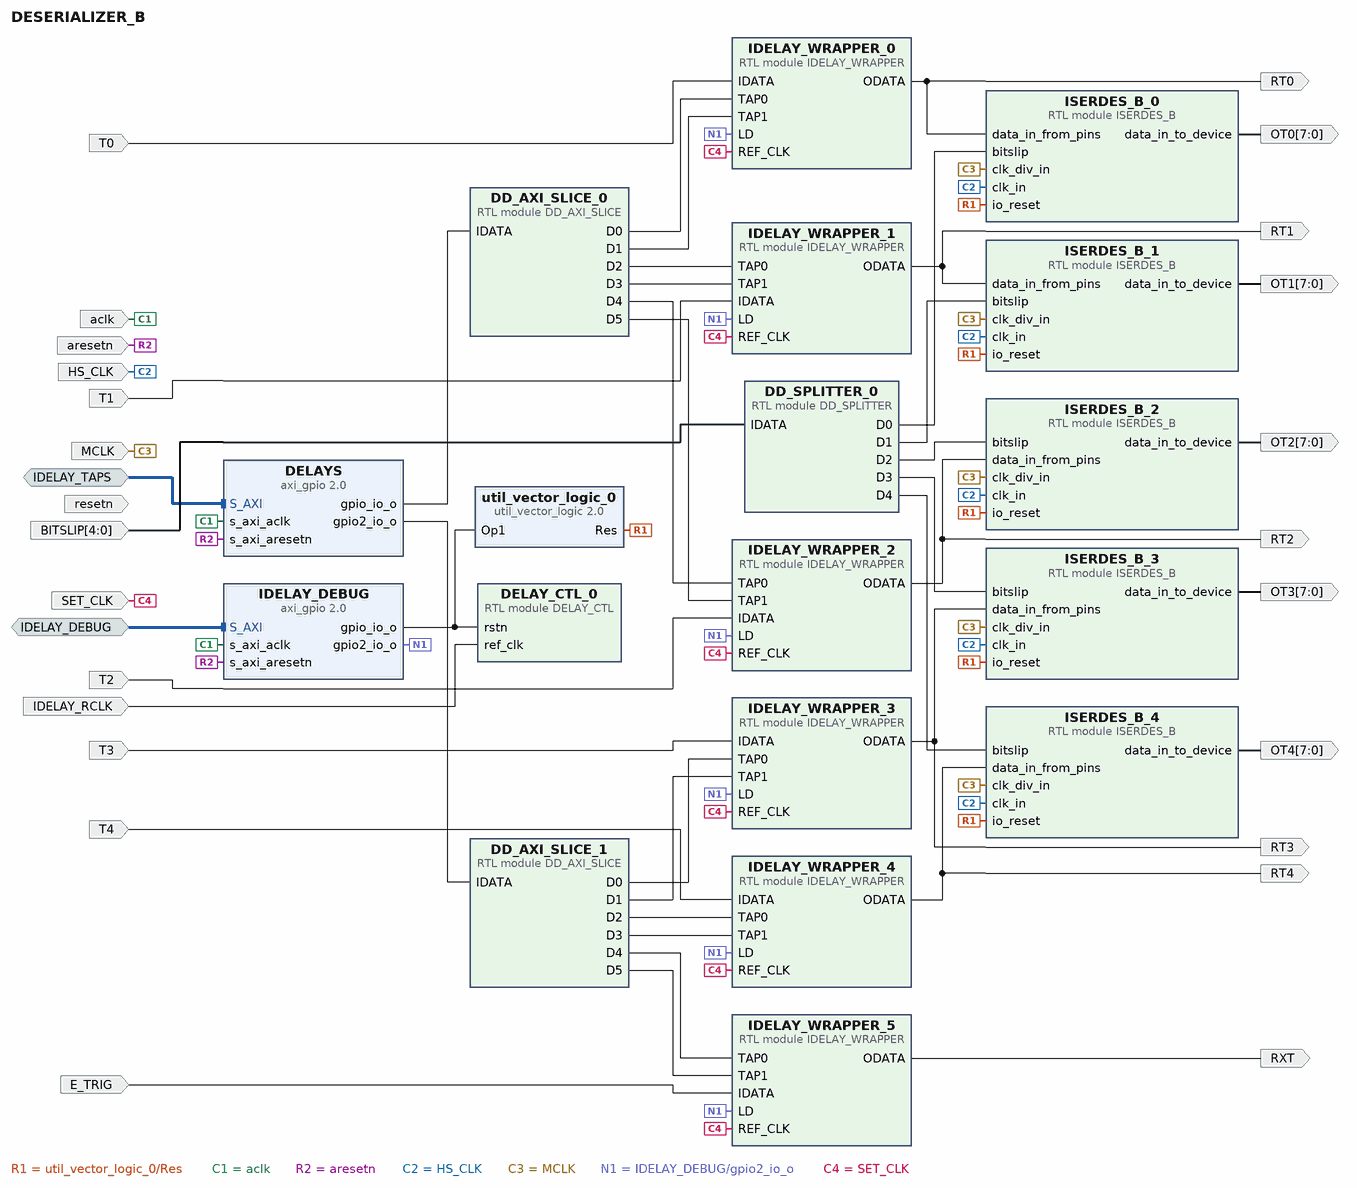
[diagram p0: block diagram of the top level]
# Vivado block design DESERIALIZER_B, xc7z020clg400-1, Vivado 2019.1
create_bd_design DESERIALIZER_B

create_bd_intf_port -mode Slave -vlnv xilinx.com:interface:aximm_tlm:1.0 IDELAY_TAPS
create_bd_intf_port -mode Slave -vlnv xilinx.com:interface:aximm_tlm:1.0 IDELAY_DEBUG
create_bd_port -dir I T0
create_bd_port -dir I T1
create_bd_port -dir I T2
create_bd_port -dir I T3
create_bd_port -dir I T4
create_bd_port -dir I E_TRIG
create_bd_port -dir I -type clk IDELAY_RCLK
set_property -dict {CONFIG.FREQ_HZ 200000000} [get_bd_ports IDELAY_RCLK]
create_bd_port -dir I -type clk HS_CLK
set_property -dict {CONFIG.FREQ_HZ 800000000} [get_bd_ports HS_CLK]
create_bd_port -dir I -type clk MCLK
set_property -dict {CONFIG.FREQ_HZ 400000000} [get_bd_ports MCLK]
create_bd_port -dir I -from 4 -to 0 BITSLIP
create_bd_port -dir I -type rst resetn
create_bd_port -dir O -from 7 -to 0 OT0
create_bd_port -dir O -from 7 -to 0 OT1
create_bd_port -dir O -from 7 -to 0 OT2
create_bd_port -dir O -from 7 -to 0 OT3
create_bd_port -dir O -from 7 -to 0 OT4
create_bd_port -dir O RT0
create_bd_port -dir O RT1
create_bd_port -dir O RT2
create_bd_port -dir O RT3
create_bd_port -dir O RT4
create_bd_port -dir O RXT
create_bd_port -dir I -type clk aclk
set_property -dict {CONFIG.FREQ_HZ 100000000} [get_bd_ports aclk]
create_bd_port -dir I -type rst aresetn
create_bd_port -dir I -type clk SET_CLK
set_property -dict {CONFIG.FREQ_HZ 460000000} [get_bd_ports SET_CLK]

create_bd_cell -type module -reference DD_SPLITTER DD_SPLITTER_0
create_bd_cell -type ip -vlnv xilinx.com:ip:util_vector_logic:2.0 util_vector_logic_0
set_property -dict {CONFIG.C_OPERATION not CONFIG.C_SIZE 1} [get_bd_cells util_vector_logic_0]
create_bd_cell -type module -reference DD_AXI_SLICE DD_AXI_SLICE_0
create_bd_cell -type module -reference DD_AXI_SLICE DD_AXI_SLICE_1
create_bd_cell -type ip -vlnv xilinx.com:ip:axi_gpio:2.0 DELAYS
set_property -dict [list \
  CONFIG.C_ALL_OUTPUTS 1 \
  CONFIG.C_ALL_OUTPUTS_2 1 \
  CONFIG.C_GPIO2_WIDTH 30 \
  CONFIG.C_GPIO_WIDTH 30 \
  CONFIG.C_IS_DUAL 1 \
] [get_bd_cells DELAYS]
create_bd_cell -type module -reference ISERDES_B ISERDES_B_0
create_bd_cell -type module -reference ISERDES_B ISERDES_B_1
create_bd_cell -type module -reference ISERDES_B ISERDES_B_2
create_bd_cell -type module -reference ISERDES_B ISERDES_B_3
create_bd_cell -type module -reference ISERDES_B ISERDES_B_4
create_bd_cell -type module -reference DELAY_CTL DELAY_CTL_0
create_bd_cell -type ip -vlnv xilinx.com:ip:axi_gpio:2.0 IDELAY_DEBUG
set_property -dict [list \
  CONFIG.C_ALL_INPUTS 0 \
  CONFIG.C_ALL_INPUTS_2 0 \
  CONFIG.C_ALL_OUTPUTS 1 \
  CONFIG.C_ALL_OUTPUTS_2 1 \
  CONFIG.C_GPIO2_WIDTH 1 \
  CONFIG.C_GPIO_WIDTH 1 \
  CONFIG.C_IS_DUAL 1 \
] [get_bd_cells IDELAY_DEBUG]
create_bd_cell -type module -reference IDELAY_WRAPPER IDELAY_WRAPPER_0
create_bd_cell -type module -reference IDELAY_WRAPPER IDELAY_WRAPPER_1
set_property -dict {CONFIG.fixed_delay 31} [get_bd_cells IDELAY_WRAPPER_1]
create_bd_cell -type module -reference IDELAY_WRAPPER IDELAY_WRAPPER_2
set_property -dict {CONFIG.fixed_delay 31} [get_bd_cells IDELAY_WRAPPER_2]
create_bd_cell -type module -reference IDELAY_WRAPPER IDELAY_WRAPPER_3
set_property -dict {CONFIG.fixed_delay 31} [get_bd_cells IDELAY_WRAPPER_3]
create_bd_cell -type module -reference IDELAY_WRAPPER IDELAY_WRAPPER_4
set_property -dict {CONFIG.fixed_delay 31} [get_bd_cells IDELAY_WRAPPER_4]
create_bd_cell -type module -reference IDELAY_WRAPPER IDELAY_WRAPPER_5

# ---- connections ----

connect_bd_intf_net [get_bd_intf_ports IDELAY_TAPS] [get_bd_intf_pins DELAYS/S_AXI]
connect_bd_intf_net [get_bd_intf_ports IDELAY_DEBUG] [get_bd_intf_pins IDELAY_DEBUG/S_AXI]
connect_bd_net [get_bd_pins IDELAY_WRAPPER_0/ODATA] [get_bd_ports RT0] [get_bd_pins ISERDES_B_0/data_in_from_pins]
connect_bd_net [get_bd_pins IDELAY_WRAPPER_1/ODATA] [get_bd_ports RT1] [get_bd_pins ISERDES_B_1/data_in_from_pins]
connect_bd_net [get_bd_pins IDELAY_WRAPPER_2/ODATA] [get_bd_ports RT2] [get_bd_pins ISERDES_B_2/data_in_from_pins]
connect_bd_net [get_bd_pins IDELAY_WRAPPER_3/ODATA] [get_bd_ports RT3] [get_bd_pins ISERDES_B_3/data_in_from_pins]
connect_bd_net [get_bd_pins IDELAY_WRAPPER_4/ODATA] [get_bd_ports RT4] [get_bd_pins ISERDES_B_4/data_in_from_pins]
connect_bd_net -net T0_1 [get_bd_ports T0] [get_bd_pins IDELAY_WRAPPER_0/IDATA]
connect_bd_net -net T1_1 [get_bd_ports T1] [get_bd_pins IDELAY_WRAPPER_1/IDATA]
connect_bd_net -net T2_1 [get_bd_ports T2] [get_bd_pins IDELAY_WRAPPER_2/IDATA]
connect_bd_net -net T3_1 [get_bd_ports T3] [get_bd_pins IDELAY_WRAPPER_3/IDATA]
connect_bd_net -net T4_1 [get_bd_ports T4] [get_bd_pins IDELAY_WRAPPER_4/IDATA]
connect_bd_net [get_bd_ports E_TRIG] [get_bd_pins IDELAY_WRAPPER_5/IDATA]
connect_bd_net [get_bd_ports IDELAY_RCLK] [get_bd_pins DELAY_CTL_0/ref_clk]
connect_bd_net [get_bd_ports BITSLIP] [get_bd_pins DD_SPLITTER_0/IDATA]
connect_bd_net -net resetn_1 [get_bd_pins IDELAY_DEBUG/gpio_io_o] [get_bd_pins util_vector_logic_0/Op1] [get_bd_pins DELAY_CTL_0/rstn]
connect_bd_net [get_bd_pins util_vector_logic_0/Res] \
  [get_bd_pins ISERDES_B_0/io_reset] [get_bd_pins ISERDES_B_1/io_reset] [get_bd_pins ISERDES_B_2/io_reset] \
  [get_bd_pins ISERDES_B_3/io_reset] [get_bd_pins ISERDES_B_4/io_reset]
connect_bd_net [get_bd_pins DD_AXI_SLICE_0/D0] [get_bd_pins IDELAY_WRAPPER_0/TAP0]
connect_bd_net [get_bd_pins DD_AXI_SLICE_0/D1] [get_bd_pins IDELAY_WRAPPER_0/TAP1]
connect_bd_net [get_bd_pins DD_AXI_SLICE_0/D2] [get_bd_pins IDELAY_WRAPPER_1/TAP0]
connect_bd_net [get_bd_pins DD_AXI_SLICE_0/D3] [get_bd_pins IDELAY_WRAPPER_1/TAP1]
connect_bd_net [get_bd_pins DD_AXI_SLICE_0/D4] [get_bd_pins IDELAY_WRAPPER_2/TAP0]
connect_bd_net [get_bd_pins DD_AXI_SLICE_0/D5] [get_bd_pins IDELAY_WRAPPER_2/TAP1]
connect_bd_net [get_bd_pins DD_AXI_SLICE_1/D0] [get_bd_pins IDELAY_WRAPPER_3/TAP0]
connect_bd_net [get_bd_pins DD_AXI_SLICE_1/D1] [get_bd_pins IDELAY_WRAPPER_3/TAP1]
connect_bd_net [get_bd_pins DD_AXI_SLICE_1/D2] [get_bd_pins IDELAY_WRAPPER_4/TAP0]
connect_bd_net [get_bd_pins DD_AXI_SLICE_1/D3] [get_bd_pins IDELAY_WRAPPER_4/TAP1]
connect_bd_net [get_bd_pins DD_AXI_SLICE_1/D4] [get_bd_pins IDELAY_WRAPPER_5/TAP0]
connect_bd_net [get_bd_pins DD_AXI_SLICE_1/D5] [get_bd_pins IDELAY_WRAPPER_5/TAP1]
connect_bd_net [get_bd_pins DELAYS/gpio_io_o] [get_bd_pins DD_AXI_SLICE_0/IDATA]
connect_bd_net [get_bd_pins DELAYS/gpio2_io_o] [get_bd_pins DD_AXI_SLICE_1/IDATA]
connect_bd_net [get_bd_pins IDELAY_WRAPPER_5/ODATA] [get_bd_ports RXT]
connect_bd_net [get_bd_ports aclk] [get_bd_pins DELAYS/s_axi_aclk] [get_bd_pins IDELAY_DEBUG/s_axi_aclk]
connect_bd_net [get_bd_ports aresetn] [get_bd_pins DELAYS/s_axi_aresetn] [get_bd_pins IDELAY_DEBUG/s_axi_aresetn]
connect_bd_net [get_bd_pins DD_SPLITTER_0/D0] [get_bd_pins ISERDES_B_0/bitslip]
connect_bd_net [get_bd_pins DD_SPLITTER_0/D1] [get_bd_pins ISERDES_B_1/bitslip]
connect_bd_net [get_bd_pins DD_SPLITTER_0/D2] [get_bd_pins ISERDES_B_2/bitslip]
connect_bd_net [get_bd_pins DD_SPLITTER_0/D3] [get_bd_pins ISERDES_B_3/bitslip]
connect_bd_net [get_bd_pins DD_SPLITTER_0/D4] [get_bd_pins ISERDES_B_4/bitslip]
connect_bd_net [get_bd_ports HS_CLK] \
  [get_bd_pins ISERDES_B_0/clk_in] [get_bd_pins ISERDES_B_1/clk_in] [get_bd_pins ISERDES_B_2/clk_in] \
  [get_bd_pins ISERDES_B_3/clk_in] [get_bd_pins ISERDES_B_4/clk_in]
connect_bd_net [get_bd_ports MCLK] \
  [get_bd_pins ISERDES_B_0/clk_div_in] [get_bd_pins ISERDES_B_1/clk_div_in] [get_bd_pins ISERDES_B_2/clk_div_in] \
  [get_bd_pins ISERDES_B_3/clk_div_in] [get_bd_pins ISERDES_B_4/clk_div_in]
connect_bd_net [get_bd_pins ISERDES_B_0/data_in_to_device] [get_bd_ports OT0]
connect_bd_net [get_bd_pins ISERDES_B_1/data_in_to_device] [get_bd_ports OT1]
connect_bd_net [get_bd_pins ISERDES_B_2/data_in_to_device] [get_bd_ports OT2]
connect_bd_net [get_bd_pins ISERDES_B_3/data_in_to_device] [get_bd_ports OT3]
connect_bd_net [get_bd_pins ISERDES_B_4/data_in_to_device] [get_bd_ports OT4]
connect_bd_net [get_bd_pins IDELAY_DEBUG/gpio2_io_o] \
  [get_bd_pins IDELAY_WRAPPER_0/LD] [get_bd_pins IDELAY_WRAPPER_1/LD] [get_bd_pins IDELAY_WRAPPER_2/LD] \
  [get_bd_pins IDELAY_WRAPPER_3/LD] [get_bd_pins IDELAY_WRAPPER_4/LD] [get_bd_pins IDELAY_WRAPPER_5/LD]
connect_bd_net [get_bd_ports SET_CLK] \
  [get_bd_pins IDELAY_WRAPPER_0/REF_CLK] [get_bd_pins IDELAY_WRAPPER_1/REF_CLK] [get_bd_pins IDELAY_WRAPPER_2/REF_CLK] \
  [get_bd_pins IDELAY_WRAPPER_3/REF_CLK] [get_bd_pins IDELAY_WRAPPER_4/REF_CLK] [get_bd_pins IDELAY_WRAPPER_5/REF_CLK]

validate_bd_design
save_bd_design
